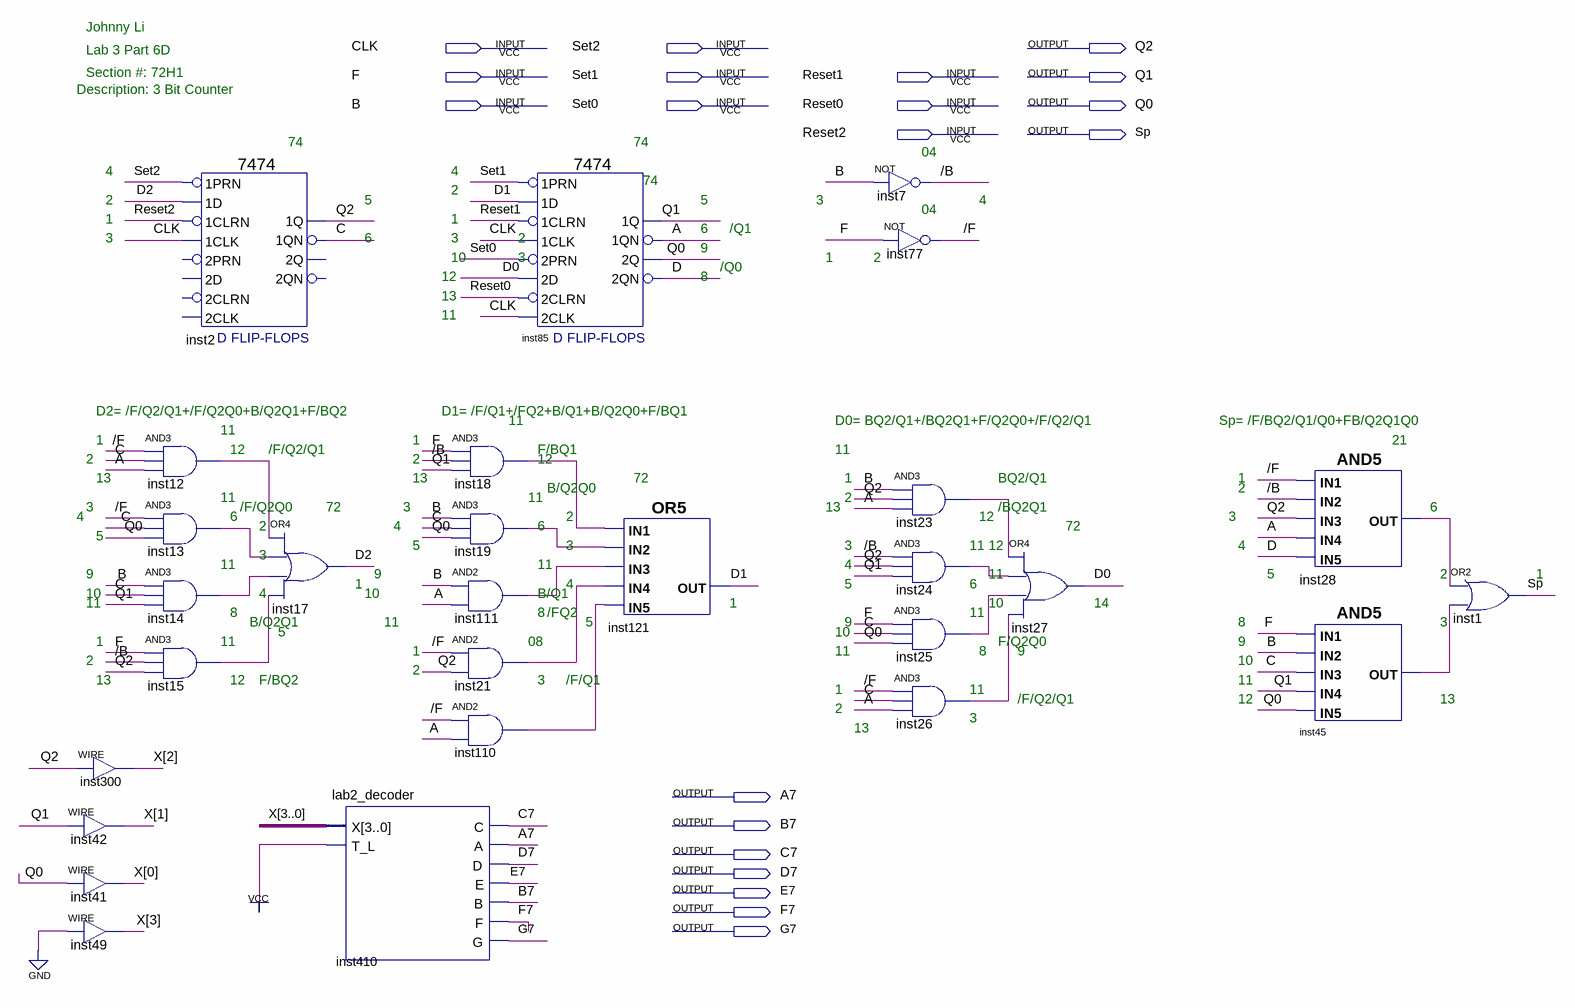
[diagram p0: schematic sheet]
// Quartus schematic Lab3_3bit_Cnt.bdf as structural Verilog: 28 symbols, 20 pins
module Lab3_3bit_Cnt (
  input  CLK,
  input  Set2,
  input  F,
  input  Set1,
  input  Reset1,
  input  B,
  input  Set0,
  input  Reset0,
  input  Reset2,
  output Q2,
  output Q1,
  output Q0,
  output Sp,
  output A7,
  output B7,
  output C7,
  output D7,
  output E7,
  output F7,
  output G7
);

  wire \/B , \/F , A, C, D, D0, D1, D2, inst12_out, inst13_out, inst14_out, inst15_out, inst18_out,
       inst19_out, inst21_out, inst23_out, inst24_out, inst25_out, inst26_out, inst28_out, inst45_out,
       inst110_out, inst111_out;
  wire [3:0] X;

  assign X[2] = Q2;  // WIRE inst300
  assign X[1] = Q1;  // WIRE inst42
  assign X[0] = Q0;  // WIRE inst41
  assign X[3] = 1'b0;  // WIRE inst49
  \7474  inst2 (
    .\1CLK (CLK), .\1D (D2), .\1PRN (Set2), .\1CLRN (Reset2), .\1QN (C), .\1Q (Q2));  // open: 2D, 2PRN, 2CLK, 2CLRN, 2Q, 2QN
  and inst12 (inst12_out, \/F , C, A);
  and inst13 (inst13_out, \/F , C, Q0);
  and inst14 (inst14_out, B, C, Q1);
  and inst15 (inst15_out, F, \/B , Q2);
  or inst17 (D2, inst12_out, inst13_out, inst14_out, inst15_out);
  lab2_decoder inst410 (.X(X), .T_L(1'b1), .C(C7), .A(A7), .D(D7), .E(E7), .B(B7), .F(F7), .G(G7));
  \7474  inst85 (
    .\2D (D0), .\2PRN (Set0), .\1CLK (CLK), .\1D (D1), .\1PRN (Set1), .\2CLK (CLK), .\2CLRN (Reset0),
    .\1CLRN (Reset1), .\1QN (A), .\2Q (Q0), .\2QN (D), .\1Q (Q1));
  and inst18 (inst18_out, F, \/B , Q1);
  and inst19 (inst19_out, B, C, Q0);
  and inst111 (inst111_out, B, A);
  and inst21 (inst21_out, \/F , Q2);
  and inst110 (inst110_out, \/F , A);
  or inst121 (D1, inst18_out, inst19_out, inst111_out, inst21_out, inst110_out);
  not inst7 (\/B , B);
  not inst77 (\/F , F);
  and inst23 (inst23_out, B, Q2, A);
  and inst24 (inst24_out, \/B , Q2, Q1);
  and inst25 (inst25_out, F, C, Q0);
  and inst26 (inst26_out, \/F , C, A);
  or inst27 (D0, inst23_out, inst24_out, inst25_out, inst26_out);
  and inst28 (inst28_out, \/F , \/B , Q2, A, D);
  and inst45 (inst45_out, F, B, C, Q1, Q0);
  or inst1 (Sp, inst28_out, inst45_out);

  // Notes on the sheet:
  //   Johnny Li 
  //   Lab 3 Part 6D 
  //   Section #: 72H1
  //   Description: 3 Bit Counter
  //   74
  //   74
  //   04
  //   4
  //   4
  //   74
  //   2
  //   2
  //   5
  //   5
  //   3
  //   4
  //   04
  //   1
  //   1
  //   6
  //   /Q1
  //   3
  //   6
  //   3
  //   2
  //   9
  //   10
  //   3
  //   1
  //   2
  //   /Q0
  //   12
  //   8
  //   13
  //   11
  //   D2= /F/Q2/Q1+/F/Q2Q0+B/Q2Q1+F/BQ2
  //   D1= /F/Q1+/FQ2+B/Q1+B/Q2Q0+F/BQ1
  //   11
  //   D0= BQ2/Q1+/BQ2Q1+F/Q2Q0+/F/Q2/Q1
  //   Sp= /F/BQ2/Q1/Q0+FB/Q2Q1Q0
  //   11
  //   1
  //   1
  //   21
  //   12
  //   /F/Q2/Q1
  //   F/BQ1
  //   11
  //   2
  //   2
  //   12
  //   13
  //   13
  //   72
  //   1
  //   BQ2/Q1
  //   1
  //   B/Q2Q0
  //   2
  //   11
  //   11
  //   2
  //   3
  //   /F/Q2Q0
  //   72
  //   3
  //   13
  //   /BQ2Q1
  //   6
  //   4
  //   6
  //   2
  //   12
  //   3
  //   2
  //   4
  //   6
  //   72
  //   5
  //   5
  //   3
  //   3
  //   11
  //   12
  //   4
  //   3
  //   11
  //   11
  //   4
  //   9
  //   9
  //   11
  //   5
  //   2
  //   1
  //   1
  //   4
  //   5
  //   6
  //   10
  //   4
  //   10
  //   B/Q1
  //   11
  //   1
  //   10
  //   14
  //   8
  //   8
  //   /FQ2
  //   11
  //   B/Q2Q1
  //   11
  //   5
  //   9
  //   8
  //   3
  //   5
  //   10
  //   1
  //   11
  //   08
  //   F/Q2Q0
  //   9
  //   1
  //   11
  //   8
  //   9
  //   2
  //   10
  //   2
  //   13
  //   12
  //   F/BQ2
  //   3
  //   /F/Q1
  //   11
  //   1
  //   11
  //   /F/Q2/Q1
  //   12
  //   13
  //   2
  //   3
  //   13
endmodule
